# EAGLE schematic dimmer for poor (EAGLE 7.5.0)
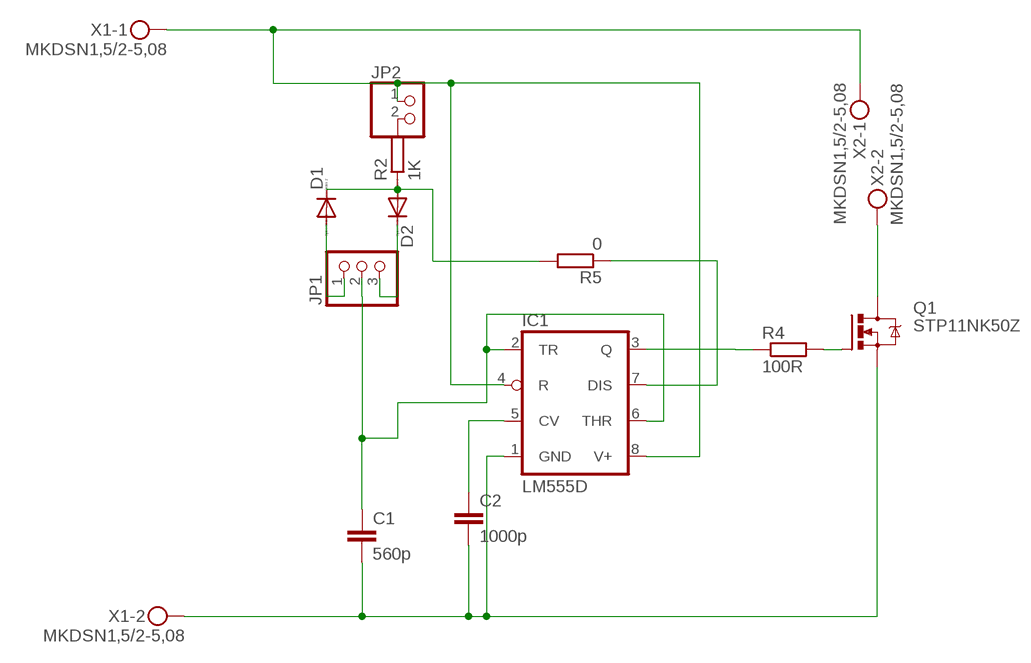
[diagram p0: schematic, sheet 1]

## Parts
C1  560p  C-EUC0805  [C0805]
C2  1000p  C-EUC1206  [C1206]
D1  DIODE-MINIMELF  [MINIMELF]
D2  DIODE-MINIMELF  [MINIMELF]
IC1  LM555D  [SO08]
JP1  PINHD-1X3/90  [1X03/90]
JP2  PINHD-1X2  [1X02]
Q1  STP11NK50Z  IRF740  [TO220BV]
R2  1K  R-EU_R0603  [R0603]
R4  100R  R-EU_R1206  [R1206]
R5  0  R-EU_R1206  [R1206]
X1  MKDSN1,5/2-5,08  [MKDSN1,5/2-5,08]
X2  MKDSN1,5/2-5,08  [MKDSN1,5/2-5,08]

## Nets
GND: C1.2 C2.2 IC1.1(GND) Q1.S X1.2
N$1: C1.1 IC1.2(TR) IC1.6(THR) JP1.2
N$2: IC1.4(R) IC1.8(V+) JP2.1 X1.1 X2.1
N$3: IC1.3(Q) R4.1
N$4: Q1.G R4.2
N$5: Q1.D X2.2
N$6: D1.C D2.A R2.1 R5.2
N$7: IC1.7(DIS) R5.1
N$8: C2.1 IC1.5(CV)
N$10: D1.A JP1.1
N$11: D2.C JP1.3
N$12: JP2.2 R2.2

## Library data of the parts
C1 C2 = rcl:C-EU: CAPACITOR, European symbol
D1 D2 = diode:DIODE-: DIODE
IC1 = linear:*555: TIMER
JP1 = pinhead:PINHD-1X3: PIN HEADER
JP2 = pinhead:PINHD-1X2: PIN HEADER
Q1 = transistor-power:IRF740: N-CHANNEL MOS FET
R2 R4 R5 = rcl:R-EU_: RESISTOR, European symbol
X1 X2 = con-phoenix-508:MKDSN1,5/2-5,08: MKDSN 1,5/ 2-5,08 Printklemme Nennstrom: 13,5 A Nennspannung: 250 V Rastermaß: 5,08 mm Polzahl: 2 Anschlussart: Schraubanschluss Montage: Löten Anschlussrichtung Leiter/Platine: 0 ° Artikelnummer: 1729128 Source: http://eshop.phoenixcontact.com .. 1729128.pdf